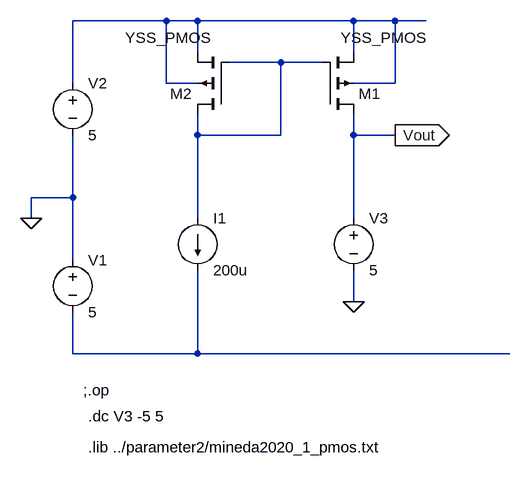
[diagram p0: schematic currentsource_test14um.asc]
currentsource_test14um.asc, the LTspice schematic file:
Version 4
SHEET 1 1536 2968
WIRE -368 -192 -512 -192
WIRE -320 -192 -368 -192
WIRE -80 -192 -320 -192
WIRE -16 -192 -80 -192
WIRE 32 -192 -16 -192
WIRE -320 -144 -320 -192
WIRE -80 -144 -80 -192
WIRE -192 -128 -272 -128
WIRE -128 -128 -192 -128
WIRE -512 -96 -512 -192
WIRE -368 -96 -368 -192
WIRE -320 -96 -368 -96
WIRE -16 -96 -16 -192
WIRE -16 -96 -80 -96
WIRE -320 -16 -320 -48
WIRE -192 -16 -192 -128
WIRE -192 -16 -320 -16
WIRE -80 -16 -80 -48
WIRE -16 -16 -80 -16
WIRE -512 80 -512 -16
WIRE -512 80 -576 80
WIRE -576 112 -576 80
WIRE -320 112 -320 -16
WIRE -80 112 -80 -16
WIRE -512 176 -512 80
WIRE -80 240 -80 192
WIRE -512 320 -512 256
WIRE -320 320 -320 192
WIRE -320 320 -512 320
WIRE 160 320 -320 320
FLAG -576 112 0
FLAG -16 -16 Vout
IOPIN -16 -16 Out
FLAG -80 240 0
SYMBOL voltage -512 160 R0
WINDOW 123 0 0 Left 2
WINDOW 39 0 0 Left 2
SYMATTR InstName V1
SYMATTR Value 5
SYMBOL pmos4 -128 -48 M180
WINDOW 3 28 118 Left 2
SYMATTR Value YSS_PMOS
SYMATTR InstName M1
SYMATTR Value2 l=14u w=14u
SYMBOL voltage -512 -112 R0
WINDOW 123 0 0 Left 2
WINDOW 39 0 0 Left 2
SYMATTR InstName V2
SYMATTR Value 5
SYMBOL current -320 112 R0
WINDOW 123 0 0 Left 2
WINDOW 39 0 0 Left 2
SYMATTR InstName I1
SYMATTR Value 200u
SYMBOL pmos4 -272 -48 R180
WINDOW 3 28 118 Left 2
SYMATTR Value YSS_PMOS
SYMATTR InstName M2
SYMATTR Value2 l=14u w=14u
SYMBOL voltage -80 96 R0
WINDOW 123 0 0 Left 2
WINDOW 39 0 0 Left 2
SYMATTR InstName V3
SYMATTR Value 5
TEXT -488 416 Left 2 !.dc V3 -5 5
TEXT -488 464 Left 2 !.lib ../parameter2/mineda2020_1_pmos.txt
TEXT -496 376 Left 2 !;.op

The netlist it stands for:
* currentsource_test14um.asc
V1 0 N003 5
M1 Vout N002 N001 N001 YSS_PMOS l=14u w=14u
V2 N001 0 5
I1 N002 N003 200u
M2 N002 N002 N001 N001 YSS_PMOS l=14u w=14u
V3 Vout 0 5
.model NMOS NMOS
.model PMOS PMOS
.lib standard.mos
.dc V3 -5 5
.lib ../parameter2/mineda2020_1_pmos.txt
;.op
.backanno
.end

* Results of the author's LTspice run, read from the files saved beside the schematic
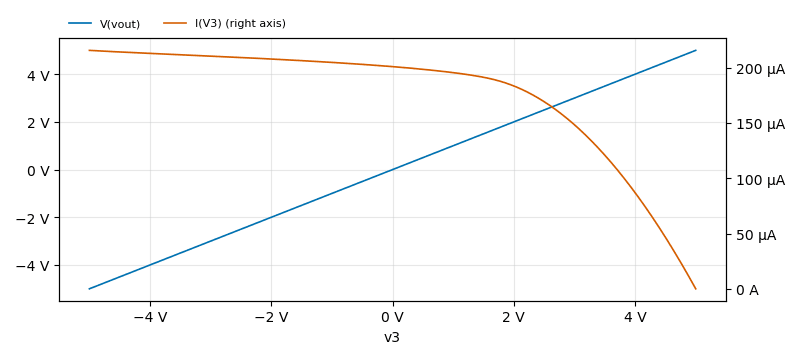
[diagram p1: DC transfer characteristic of currentsource_test14um.asc, plotted from the saved traces]
* DC transfer characteristic, 1 run:
*   V(vout): -5 V at v3=-5 V, 5 V at v3=5 V, min -5 V, max 5 V
*   I(V3): 215.6 µA at v3=-5 V, 0 A at v3=5 V, min 0 A, max 215.6 µA